# Altium schematic sheet STPM34Energy_measurement.SchDoc: STPM34 Power Measurement
size A4; Author: Vatsal Sheth; DrawnBy: Vatsal Sheth; Engineer: Vatsal Sheth; Organization: University of Colorado; Address1: Boulder; Address2: Bhishma; Address3: Low Power Embedded; Address4: Design Techniques; Revision: 0.1; SheetNumber: 9; SheetTotal: 9; ProjectName: Bhishma
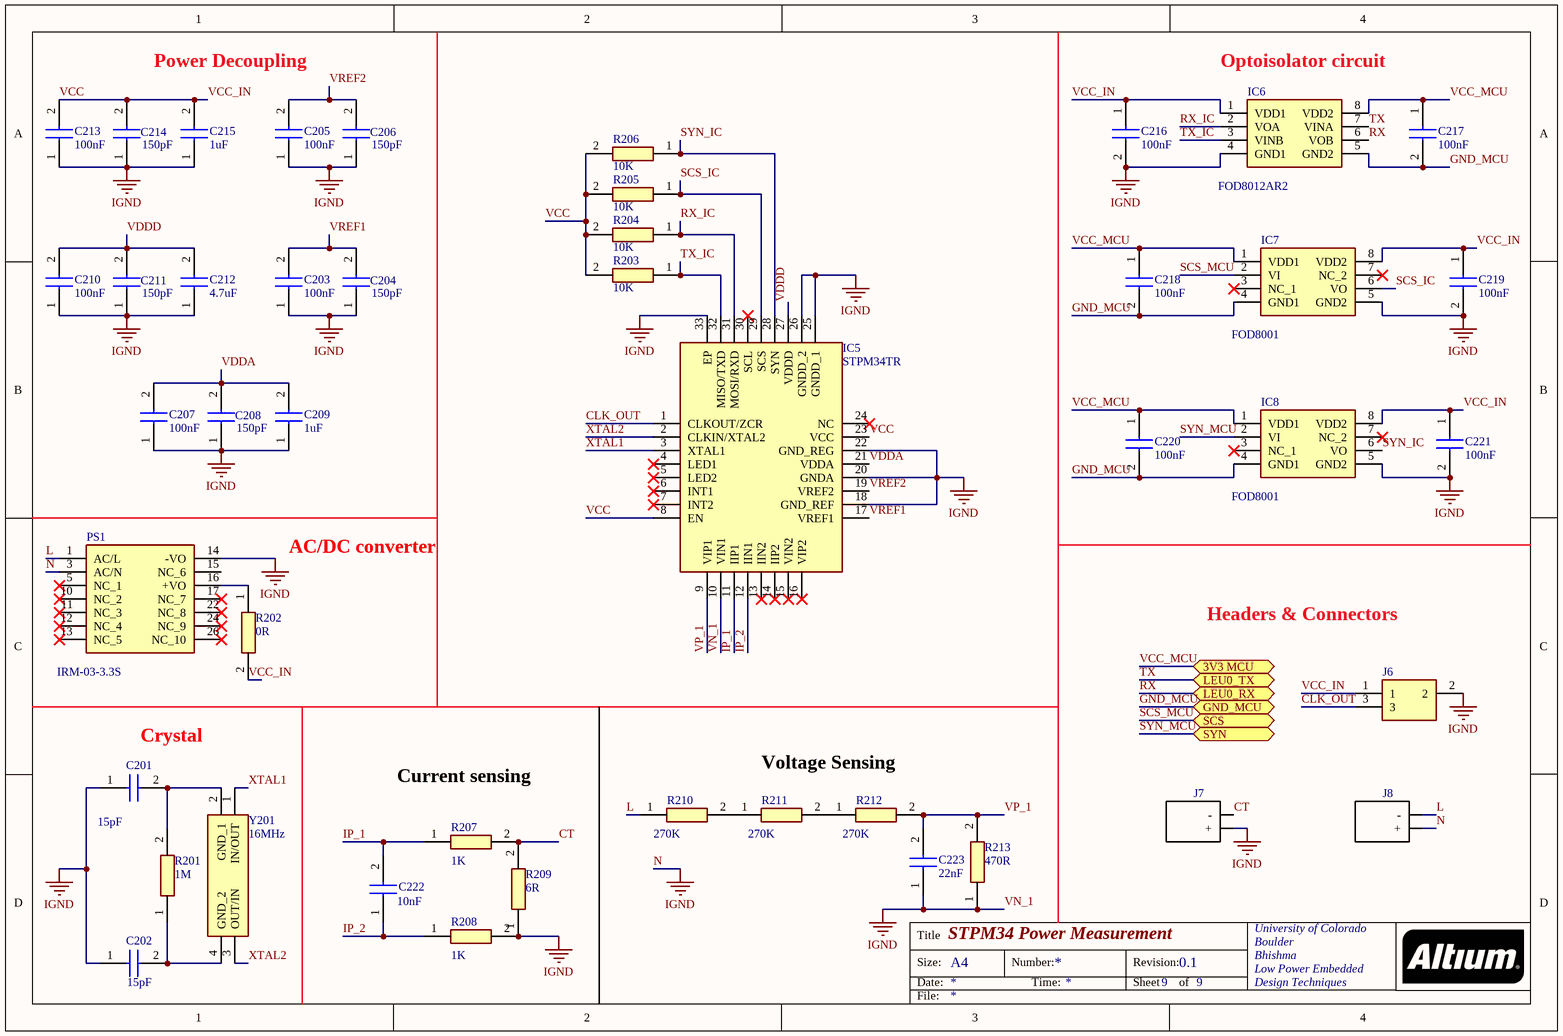
[diagram p0: STPM34Energy_measurement.SchDoc]

## Parts
C201  value 15pF  [CAPC1608X87N]  (hidden comment: 80-C0603C150F5GACTU)
C202  value 15pF  [CAPC1608X87N]  (hidden comment: 80-C0603C150F5GACTU)
C203  value 100nF  [CAPC1608X90N]  (hidden comment: 581-0603YC104JAT4A)
C204  value 150pF  [CAPC1608X87N]  (hidden comment: 80-C0603C151J4G)
C205  value 100nF  [CAPC1608X90N]  (hidden comment: 581-0603YC104JAT4A)
C206  value 150pF  [CAPC1608X87N]  (hidden comment: 80-C0603C151J4G)
C207  value 100nF  [CAPC1608X90N]  (hidden comment: 581-0603YC104JAT4A)
C208  value 150pF  [CAPC1608X87N]  (hidden comment: 80-C0603C151J4G)
C209  value 1uF  [CAPC1608X90N]  (hidden comment: 81-GCM188R71C105K64D)
C210  value 100nF  [CAPC1608X90N]  (hidden comment: 581-0603YC104JAT4A)
C211  value 150pF  [CAPC1608X87N]  (hidden comment: 80-C0603C151J4G)
C212  value 4.7uF  [CAPC1608X90N]  (hidden comment: 81-GRM188R61C475KAJD)
C213  value 100nF  [CAPC1608X90N]  (hidden comment: 581-0603YC104JAT4A)
C214  value 150pF  [CAPC1608X87N]  (hidden comment: 80-C0603C151J4G)
C215  value 1uF  [CAPC1608X90N]  (hidden comment: 81-GCM188R71C105K64D)
C216  value 100nF  [CAPC1608X90N]  (hidden comment: 581-0603YC104JAT4A)
C217  value 100nF  [CAPC1608X90N]  (hidden comment: 581-0603YC104JAT4A)
C218  value 100nF  [CAPC1608X90N]  (hidden comment: 581-0603YC104JAT4A)
C219  value 100nF  [CAPC1608X90N]  (hidden comment: 581-0603YC104JAT4A)
C220  value 100nF  [CAPC1608X90N]  (hidden comment: 581-0603YC104JAT4A)
C221  value 100nF  [CAPC1608X90N]  (hidden comment: 581-0603YC104JAT4A)
C222  value 10nF  [CAPC1608X90N]  (hidden comment: 81-GCM1887U1H103JA6J)
C223  value 22nF  [CAPC1608X90N]  (hidden comment: 81-GRM1887U1A223JA1D)
IC5  value STPM34TR  [QFN50P500X500X100-33N-D]  (hidden comment: 511-STPM34TR)
IC6  value FOD8012AR2  [SOIC127P594X363-8N]  (hidden comment: 512-FOD8012AR2)
IC7  value FOD8001  [SOIC127P594X363-8N]  (hidden comment: 512-FOD8001)
IC8  value FOD8001  [SOIC127P594X363-8N]  (hidden comment: 512-FOD8001)
J6  538-87898-0306  [878980306]  (value not drawn)
J7  710-691508110302  [691508110302]  (value not drawn)
J8  710-691508110302  [691508110302]  (value not drawn)
PS1  value IRM-03-3.3S  [IRM035S]  (hidden comment: 709-IRM03-3.3S)
R201  value 1M  [RESC1608X55N]  (hidden comment: 594-MCT06030C1004FP5)
R202  value 0R  [RESC3216X60N]  (hidden comment: 71-CRCW12060000Z0EAC)
R203  value 10K  [RESC1608X55N]  (hidden comment: 594-MCT0603MD1002BP5)
R204  value 10K  [RESC1608X55N]  (hidden comment: 594-MCT0603MD1002BP5)
R205  value 10K  [RESC1608X55N]  (hidden comment: 594-MCT0603MD1002BP5)
R206  value 10K  [RESC1608X55N]  (hidden comment: 594-MCT0603MD1002BP5)
R207  value 1K  [RESC1608X55N]  (hidden comment: 594-MCT0603PD1001DP5)
R208  value 1K  [RESC1608X55N]  (hidden comment: 594-MCT0603PD1001DP5)
R209  value 6R  [RESC1608X55N]  (hidden comment: 279-CPF0603B5R9E1)
R210  value 270K  [RESC1608X55N]  (hidden comment: 594-MCT06030C2703FP5)
R211  value 270K  [RESC1608X55N]  (hidden comment: 594-MCT06030C2703FP5)
R212  value 270K  [RESC1608X55N]  (hidden comment: 594-MCT06030C2703FP5)
R213  value 470R  [RESC1608X55N]  (hidden comment: 667-ERA-3APB471V)
Y201  value 16MHz  [ECS240836QAESTR]  (hidden comment: 520-160-8-36B-CKYT)

## Ports
3V3 MCU, GND_MCU, LEU0_RX, LEU0_TX, SCS, SYN

## Nets
N: C201.1 C202.1 C203.1 C204.1 C205.1 C206.1 C207.1 C208.1 C209.1 C210.1 C211.1 C212.1 C213.1 C214.1 C215.1 C216.2 C219.2 C221.2 C223.1 IC5.10(VIN1) IC5.18(GND_REF) IC5.20(GNDA) IC5.22(GND_REG) IC5.25(GNDD_1) IC5.26(GNDD_2) IC5.33(EP) IC6.4(GND1) IC7.5(GND2) IC8.5(GND2) J6.2 J7.2(+) J8.2(+) PS1.3(AC/N) PS1.14(-VO) R208.2 R209.1 R213.1  [also labelled IGND, VN_1]
CLK_OUT: IC5.1(CLKOUT/ZCR) J6.3
CT: J7.1(-) R207.2 R209.2
GND_MCU: C217.2 C218.2 C220.2 IC6.5(GND2) IC7.4(GND1) IC8.4(GND1) ; port GND_MCU
IP_1: C222.2 IC5.11(IIP1) R207.1
IP_2: C222.1 IC5.12(IIN1) R208.1
L: J8.1(-) PS1.1(AC/L) R210.1
RX: IC6.6(VOB) ; port LEU0_RX
RX_IC: IC5.31(MOSI/RXD) IC6.2(VOA) R204.1
SCS_IC: IC5.29(SCS) IC7.6(VO) R205.1
SCS_MCU: IC7.2(VI) ; port SCS
SYN_IC: IC5.28(SYN) IC8.6(VO) R206.1
SYN_MCU: IC8.2(VI) ; port SYN
TX: IC6.7(VINA) ; port LEU0_TX
TX_IC: IC5.32(MISO/TXD) IC6.3(VINB) R203.1
VCC: C213.2 C214.2 C215.2 C216.1 C219.1 C221.1 IC5.8(EN) IC5.23(VCC) IC6.1(VDD1) IC7.8(VDD2) IC8.8(VDD2) J6.1 R202.2 R203.2 R204.2 R205.2 R206.2  [also labelled VCC_IN]
VCC_MCU: C217.1 C218.1 C220.1 IC6.8(VDD2) IC7.1(VDD1) IC8.1(VDD1) ; port 3V3 MCU
VDDA: C207.2 C208.2 C209.2 IC5.21(VDDA)
VDDD: C210.2 C211.2 C212.2 IC5.27(VDDD)
VP_1: C223.2 IC5.9(VIP1) R212.2 R213.2
VREF1: C203.2 C204.2 IC5.17(VREF1)
VREF2: C205.2 C206.2 IC5.19(VREF2)
XTAL1: IC5.3(XTAL1) Y201.1(IN/OUT)
XTAL2: IC5.2(CLKIN/XTAL2) Y201.3(OUT/IN)
NetC201_2: C201.2 R201.2 Y201.2(GND_1)
NetC202_2: C202.2 R201.1 Y201.4(GND_2)
NetPS1_16: PS1.16(+VO) R202.1
NetR210_2: R210.2 R211.1
NetR211_2: R211.2 R212.1

Not connected (* = marked no-connect by the designer): IC5 4(LED1)* 5(LED2)* 6(INT1)* 7(INT2)* 13(IIN2)* 14(IIP2)* 15(VIN2)* 16(VIP2)* 24(NC)* 30(SCL)*; IC7 3(NC_1)* 7(NC_2)*; IC8 3(NC_1)* 7(NC_2)*; PS1 5(NC_1)* 10(NC_2)* 11(NC_3)* 12(NC_4)* 13(NC_5)* 15(NC_6) 17(NC_7)* 22(NC_8)* 24(NC_9)* 26(NC_10)*

## Notes on the sheet
- Power Decoupling
- Optoisolator circuit
- AC/DC converter
- Headers & Connectors
- (near C201) Crystal
- Current sensing
- Voltage Sensing
- Title
- Size:
- Date:
- A4
- Number:
- Time:
- Revision:
- Sheet
- of
- File:

## Library data of the parts
C201 C202 = C0603C150F5GACTU: Capacitor; Manufacturer_Name: Kemet; Datasheet Link: https://content.kemet.com/datasheets/KEM_C1003_C0G_SMD.pdf; Height: 0.87mm; Manufacturer_Part_Number: C0603C150F5GACTU; Mouser Part Number: 80-C0603C150F5GACTU; Mouser Price/Stock: https://www.mouser.com/Search/Refine.aspx?Keyword=80-C0603C150F5GACTU
C203 C205 C207 C210 C213 C216-C221 = 0603YC104JAT4A: Capacitor; Manufacturer_Name: AVX; Datasheet Link: https://componentsearchengine.com/Datasheets/1/06031A100FAT2A.pdf; Height: 0.9mm; Manufacturer_Part_Number: 0603YC104JAT4A; Mouser Part Number: 581-0603YC104JAT4A; Mouser Price/Stock: https://www.mouser.com/Search/Refine.aspx?Keyword=581-0603YC104JAT4A
C204 C206 C208 C211 C214 = C0603C151J4GACTU: Capacitor; Manufacturer_Name: Kemet; Datasheet Link: https://content.kemet.com/datasheets/KEM_C1003_C0G_SMD.pdf; Height: 0.87mm; Manufacturer_Part_Number: C0603C151J4GACTU; Mouser Part Number: 80-C0603C151J4G; Mouser Price/Stock: https://www.mouser.com/Search/Refine.aspx?Keyword=80-C0603C151J4G
C209 C215 = GCM188R71C105KA64D: Capacitor; Manufacturer_Name: Murata Electronics; Datasheet Link: https://psearch.en.murata.com/capacitor/product/GCM188R71C105KA64%23.html; Height: 0.9mm; Manufacturer_Part_Number: GCM188R71C105KA64D; Mouser Part Number: 81-GCM188R71C105K64D; Mouser Price/Stock: https://www.mouser.com/Search/Refine.aspx?Keyword=81-GCM188R71C105K64D; RS Part Number: 7900562P; RS Price/Stock: http://uk.rs-online.com/web/p/products/7900562P
C212 = GRM188R61C475KAAJD: Capacitor; Manufacturer_Name: Murata Electronics; Datasheet Link: http://www.murata.com/~/media/webrenewal/support/library/catalog/products/capacitor/mlcc/c02e.pdf; Height: 0.9mm; Manufacturer_Part_Number: GRM188R61C475KAAJD; Mouser Part Number: 81-GRM188R61C475KAJD; Mouser Price/Stock: https://www.mouser.com/Search/Refine.aspx?Keyword=81-GRM188R61C475KAJD; RS Part Number: 8847264; RS Price/Stock: https://uk.rs-online.com/web/p/products/8847264
C222 = GCM1887U1H103JA16J: Capacitor; Manufacturer_Name: Murata Electronics; Datasheet Link: https://psearch.en.murata.com/capacitor/product/GCM1887U1H103JA16%23.html; Height: 0.9mm; Manufacturer_Part_Number: GCM1887U1H103JA16J; Mouser Part Number: 81-GCM1887U1H103JA6J; Mouser Price/Stock: https://www.mouser.com/Search/Refine.aspx?Keyword=81-GCM1887U1H103JA6J
C223 = GRM1887U1A223JA01D: Capacitor; Manufacturer_Name: Murata Electronics; Datasheet Link: https://psearch.en.murata.com/capacitor/product/GRM1887U1A223JA01%23.html; Height: 0.9mm; Manufacturer_Part_Number: GRM1887U1A223JA01D; Mouser Part Number: 81-GRM1887U1A223JA1D; Mouser Price/Stock: https://www.mouser.com/Search/Refine.aspx?Keyword=81-GRM1887U1A223JA1D
IC5 = STPM34TR: Integrated Circuit; Manufacturer_Name: STMicroelectronics; Datasheet Link: http://www.st.com/content/ccc/resource/technical/document/datasheet/d9/c1/c6/3d/09/7f/4f/7b/DM00111861.pdf/files/DM00111861.pdf/jcr:content/translations/en.DM00111861.pdf; Height: 1mm; Manufacturer_Part_Number: STPM34TR; Mouser Part Number: 511-STPM34TR; Mouser Price/Stock: https://www.mouser.com/Search/Refine.aspx?Keyword=511-STPM34TR
IC6 = FOD8012AR2: Integrated Circuit; Manufacturer_Name: Fairchild Semiconductor; Datasheet Link: https://www.onsemi.com/pub/Collateral/FOD8012A-D.pdf; Height: 3.63mm; Manufacturer_Part_Number: FOD8012AR2; Mouser Part Number: 512-FOD8012AR2; Mouser Price/Stock: https://www.mouser.com/Search/Refine.aspx?Keyword=512-FOD8012AR2
IC7 IC8 = FOD8001: Integrated Circuit; Manufacturer_Name: Fairchild Semiconductor; Datasheet Link: https://www.mouser.com/ds/2/308/FOD8001-1124391.pdf; Height: 3.63mm; Manufacturer_Part_Number: FOD8001; Mouser Part Number: 512-FOD8001; Mouser Price/Stock: https://www.mouser.com/Search/Refine.aspx?Keyword=512-FOD8001
J6 = 87898-0306: Connector; Manufacturer_Name: Molex; Allied_Number: 71465806; Datasheet Link: http://www.molex.com/pdm_docs/sd/878980306_sd.pdf; Height: 10.81mm; Manufacturer_Part_Number: 87898-0306; Mouser Part Number: 538-87898-0306; Mouser Price/Stock: https://www.mouser.com/Search/Refine.aspx?Keyword=538-87898-0306; Allied Price/Stock: https://www.alliedelec.com/molexincorporated-87898-0306/71465806/
J7 J8 = 691508110302: 5081 Series 3.5mm Pitch Horizontal, PCBTerminal Block, Surface Mount, 2 Way; Manufacturer_Name: Wurth Electronics; Manufacturer_Part_Number: 691508110302; Datasheet Link: https://www.mouser.com/datasheet/2/445/6915081103xx-469297.pdf; Mouser Part Number: 710-691508110302; Value: *
PS1 = IRM-03-3.3S: Power Supply; Manufacturer_Name: Mean Well; Datasheet Link: https://www.meanwell.com/Upload/PDF/IRM-03/IRM-03-SPEC.PDF; Height: 16mm; Mouser Part Number: 709-IRM03-3.3S; Mouser Price/Stock: https://www.mouser.com/Search/Refine.aspx?Keyword=709-IRM03-3.3S; Manufacturer_Part_Number: IRM-03-3.3S
R201 = MCT06030C1004FP500: Resistor; Manufacturer_Name: Vishay; Datasheet Link: http://www.vishay.com/docs/28705/mcx0x0xpro.pdf; Height: 0.55mm; Manufacturer_Part_Number: MCT06030C1004FP500; Mouser Part Number: 594-MCT06030C1004FP5; Mouser Price/Stock: https://www.mouser.com/Search/Refine.aspx?Keyword=594-MCT06030C1004FP5
R202 = CRCW12060000Z0EAC: Resistor; Manufacturer_Name: Vishay; Datasheet Link: http://componentsearchengine.com/Datasheets/1/CRCW12060000Z0EAC.pdf; Height: 0.6mm; Manufacturer_Part_Number: CRCW12060000Z0EAC; Mouser Part Number: 71-CRCW12060000Z0EAC; Mouser Price/Stock: https://www.mouser.com/Search/Refine.aspx?Keyword=71-CRCW12060000Z0EAC
R203-R206 = MCT0603MD1002BP500: Resistor; Manufacturer_Name: Vishay; Datasheet Link: http://www.vishay.com/docs/28705/mcx0x0xpro.pdf; Height: 0.55mm; Manufacturer_Part_Number: MCT0603MD1002BP500; Mouser Part Number: 594-MCT0603MD1002BP5; Mouser Price/Stock: https://www.mouser.com/Search/Refine.aspx?Keyword=594-MCT0603MD1002BP5
R207 R208 = MCT0603PD1001DP500: Resistor; Manufacturer_Name: Vishay; Datasheet Link: http://www.vishay.com/docs/28705/mcx0x0xpro.pdf; Height: 0.55mm; Manufacturer_Part_Number: MCT0603PD1001DP500; Mouser Part Number: 594-MCT0603PD1001DP5; Mouser Price/Stock: https://www.mouser.com/Search/Refine.aspx?Keyword=594-MCT0603PD1001DP5
R209 = CPF0603B5R9E1: Resistor; Manufacturer_Name: TE Connectivity; Datasheet Link: http://www.farnell.com/datasheets/1786775.pdf; Height: 0.55mm; Manufacturer_Part_Number: CPF0603B5R9E1; Mouser Part Number: 279-CPF0603B5R9E1; RS Part Number: 1235327; RS Price/Stock: https://uk.rs-online.com/web/p/products/1235327
R210-R212 = MCT06030C2703FP500: Resistor; Manufacturer_Name: Vishay; Datasheet Link: http://www.vishay.com/docs/28705/mcx0x0xpro.pdf; Height: 0.55mm; Manufacturer_Part_Number: MCT06030C2703FP500; Mouser Part Number: 594-MCT06030C2703FP5; Mouser Price/Stock: https://www.mouser.com/Search/Refine.aspx?Keyword=594-MCT06030C2703FP5
R213 = ERA-3APB471V: Resistor; Manufacturer_Name: Panasonic; Allied_Number: 70360364; Datasheet Link: https://industrial.panasonic.com/cdbs/www-data/pdf/RDM0000/AOA0000C307.pdf; Height: 0.55mm; Manufacturer_Part_Number: ERA-3APB471V; Mouser Part Number: 667-ERA-3APB471V; Mouser Price/Stock: https://www.mouser.com/Search/Refine.aspx?Keyword=667-ERA-3APB471V; Allied Price/Stock: https://www.alliedelec.com/panasonic-era3apb471v/70360364/
Y201 = ECS-160-8-36B-CKY-TR: Crystal or Oscillator; Manufacturer_Name: ECS; Datasheet Link: https://ecsxtal.com/store/pdf/ECX-2236B.pdf; Height: 0mm; Manufacturer_Part_Number: ECS-160-8-36B-CKY-TR; Mouser Part Number: 520-160-8-36B-CKYT; Mouser Price/Stock: https://www.mouser.com/Search/Refine.aspx?Keyword=520-160-8-36B-CKYT